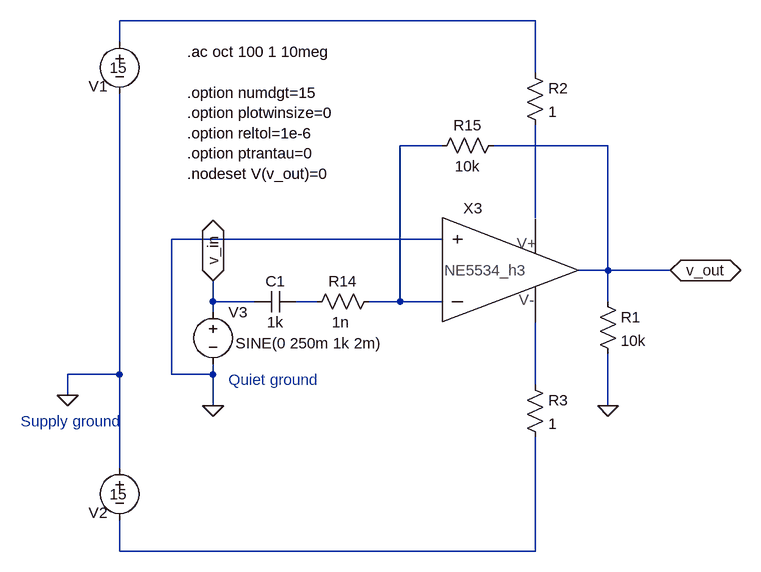
[diagram p0: schematic NE5534_h3 (open loop).asc]
NE5534_h3 (open loop).asc, the LTspice schematic file:
Version 4
SHEET 1 880 1160
WIRE -4144 -432 -4784 -432
WIRE -4784 -400 -4784 -432
WIRE -4144 -352 -4144 -432
WIRE -4288 -240 -4352 -240
WIRE -4032 -240 -4208 -240
WIRE -4144 -128 -4144 -272
WIRE -4288 -96 -4704 -96
WIRE -4032 -48 -4032 -240
WIRE -4032 -48 -4080 -48
WIRE -3936 -48 -4032 -48
WIRE -4640 0 -4640 -32
WIRE -4576 0 -4640 0
WIRE -4480 0 -4512 0
WIRE -4352 0 -4352 -240
WIRE -4352 0 -4400 0
WIRE -4288 0 -4352 0
WIRE -4032 0 -4032 -48
WIRE -4640 16 -4640 0
WIRE -4784 112 -4784 -320
WIRE -4784 112 -4864 112
WIRE -4704 112 -4704 -96
WIRE -4640 112 -4640 96
WIRE -4640 112 -4704 112
WIRE -4144 128 -4144 32
WIRE -4864 144 -4864 112
WIRE -4640 160 -4640 112
WIRE -4032 160 -4032 80
WIRE -4784 256 -4784 112
WIRE -4784 384 -4784 336
WIRE -4144 384 -4144 208
WIRE -4144 384 -4784 384
FLAG -4640 160 0
FLAG -4864 144 0
FLAG -3936 -48 v_out
IOPIN -3936 -48 BiDir
FLAG -4640 -32 v_in
IOPIN -4640 -32 BiDir
FLAG -4032 160 0
SYMBOL voltage -4640 0 R0
WINDOW 39 0 0 Left 0
WINDOW 3 35 64 Left 0
SYMATTR Value SINE(0 250m 1k 2m)
SYMATTR Value2 AC 1
SYMATTR InstName V3
SYMBOL res -4384 -16 R90
WINDOW 0 0 56 VBottom 0
WINDOW 3 32 59 VTop 0
SYMATTR InstName R14
SYMATTR Value 1n
SYMBOL res -4192 -256 R90
WINDOW 0 0 56 VBottom 0
WINDOW 3 32 56 VTop 0
SYMATTR InstName R15
SYMATTR Value 10k
SYMBOL voltage -4784 -416 M0
WINDOW 0 18 85 Left 0
WINDOW 3 -12 56 Left 0
WINDOW 123 0 0 Left 0
WINDOW 39 0 0 Left 0
SYMATTR InstName V1
SYMATTR Value 15
SYMBOL voltage -4784 240 M0
WINDOW 0 18 85 Left 0
WINDOW 3 -12 56 Left 0
WINDOW 123 0 0 Left 0
WINDOW 39 0 0 Left 0
SYMATTR InstName V2
SYMATTR Value 15
SYMBOL res -4048 -16 R0
SYMATTR InstName R1
SYMATTR Value 10k
SYMBOL res -4160 -368 R0
SYMATTR InstName R2
SYMATTR Value 1
SYMBOL res -4160 112 R0
SYMATTR InstName R3
SYMATTR Value 1
SYMBOL cap -4576 16 R270
WINDOW 0 32 32 VTop 0
WINDOW 3 0 32 VBottom 0
SYMATTR InstName C1
SYMATTR Value 1k
SYMBOL NE5534_h3 -4192 -48 R0
SYMATTR InstName X3
TEXT -4680 -384 Left 0 !.ac oct 100 1 10meg\n \n.option numdgt=15\n.option plotwinsize=0\n.option reltol=1e-6\n.option ptrantau=0\n.nodeset V(v_out)=0
TEXT -4616 120 Left 0 ;Quiet ground
TEXT -4936 184 Left 0 ;Supply ground

The netlist it stands for:
* NE5534_h3 (open loop).asc
V3 v_in 0 SINE(0 250m 1k 2m) AC 1
R14 N002 N004 1n
R15 v_out N002 10k
V1 N001 0 15
V2 0 N006 15
R1 v_out 0 10k
R2 N001 N003 1
R3 N005 N006 1
C1 v_in N004 1k
XX3 0 N003 v_out N005 N002 NE5534_h3  ; pins +in V+ out V- -in
.ac oct 100 1 10meg
.option numdgt=15
.option plotwinsize=0
.option reltol=1e-6
.option ptrantau=0
.nodeset V(v_out)=0
* Quiet ground
* Supply ground
.backanno
.end